# EAGLE schematic GateRhythm (EAGLE 6.5.0)
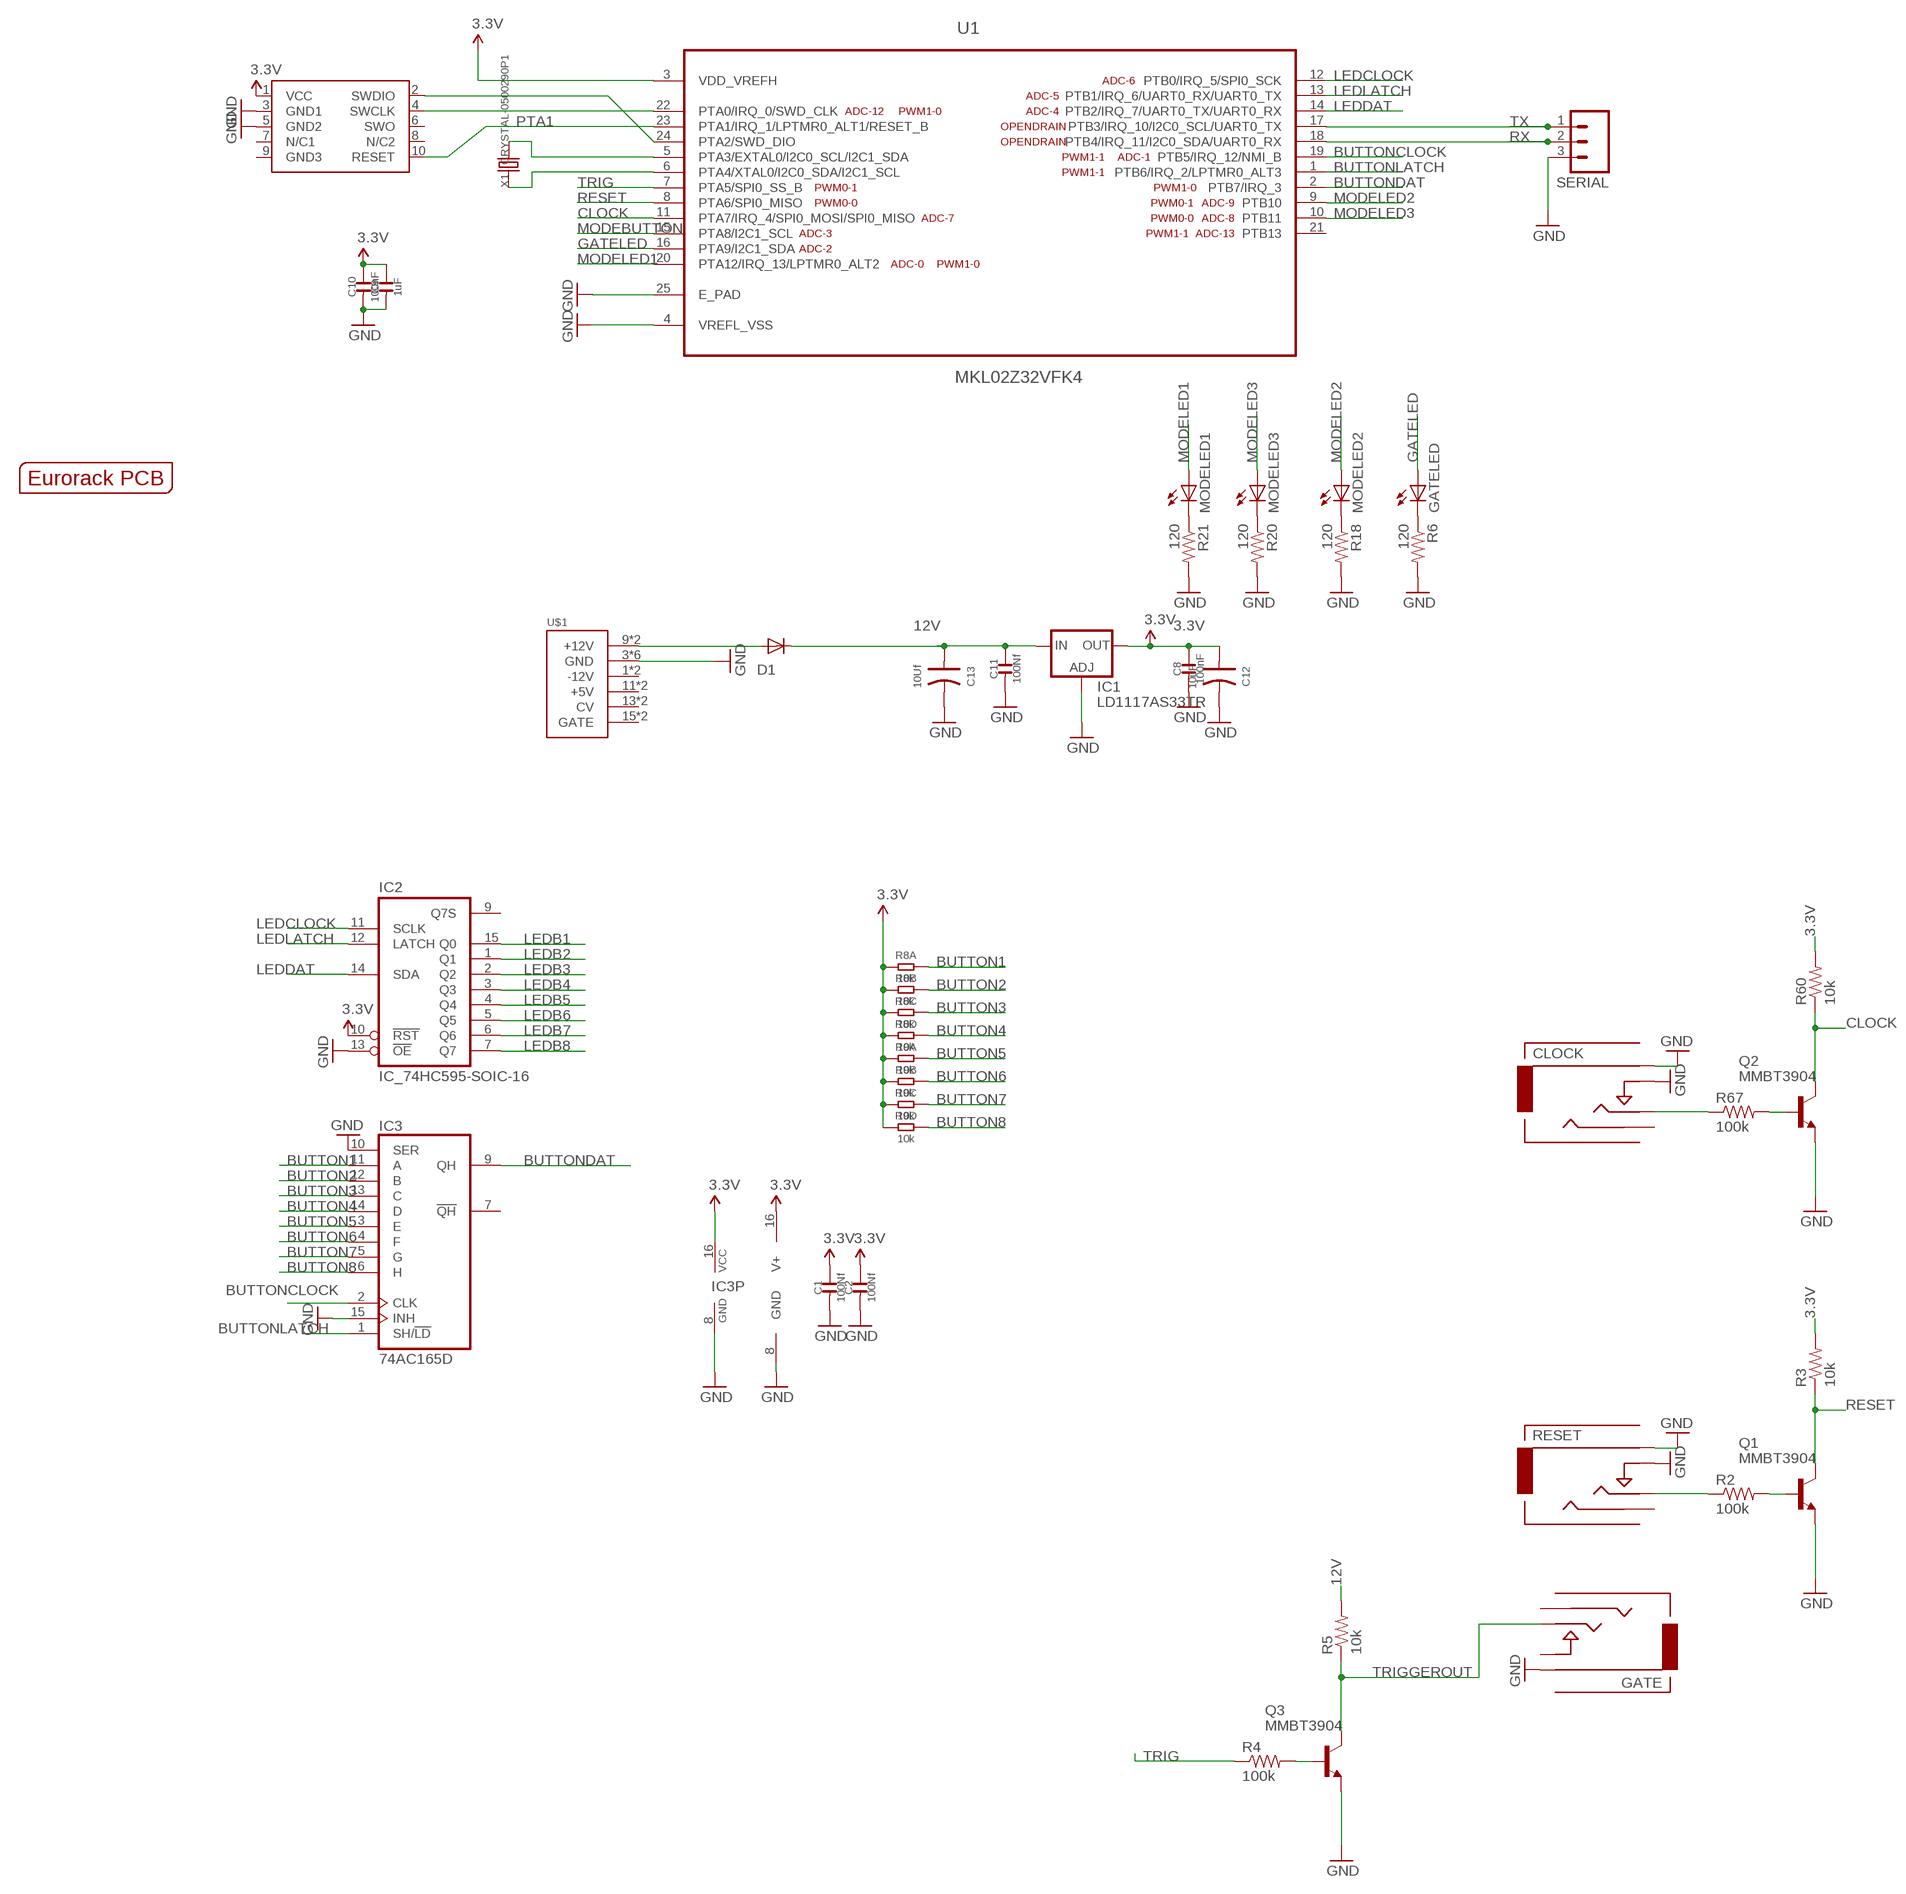
[diagram p0: schematic, sheet 1, part 1 of 2]
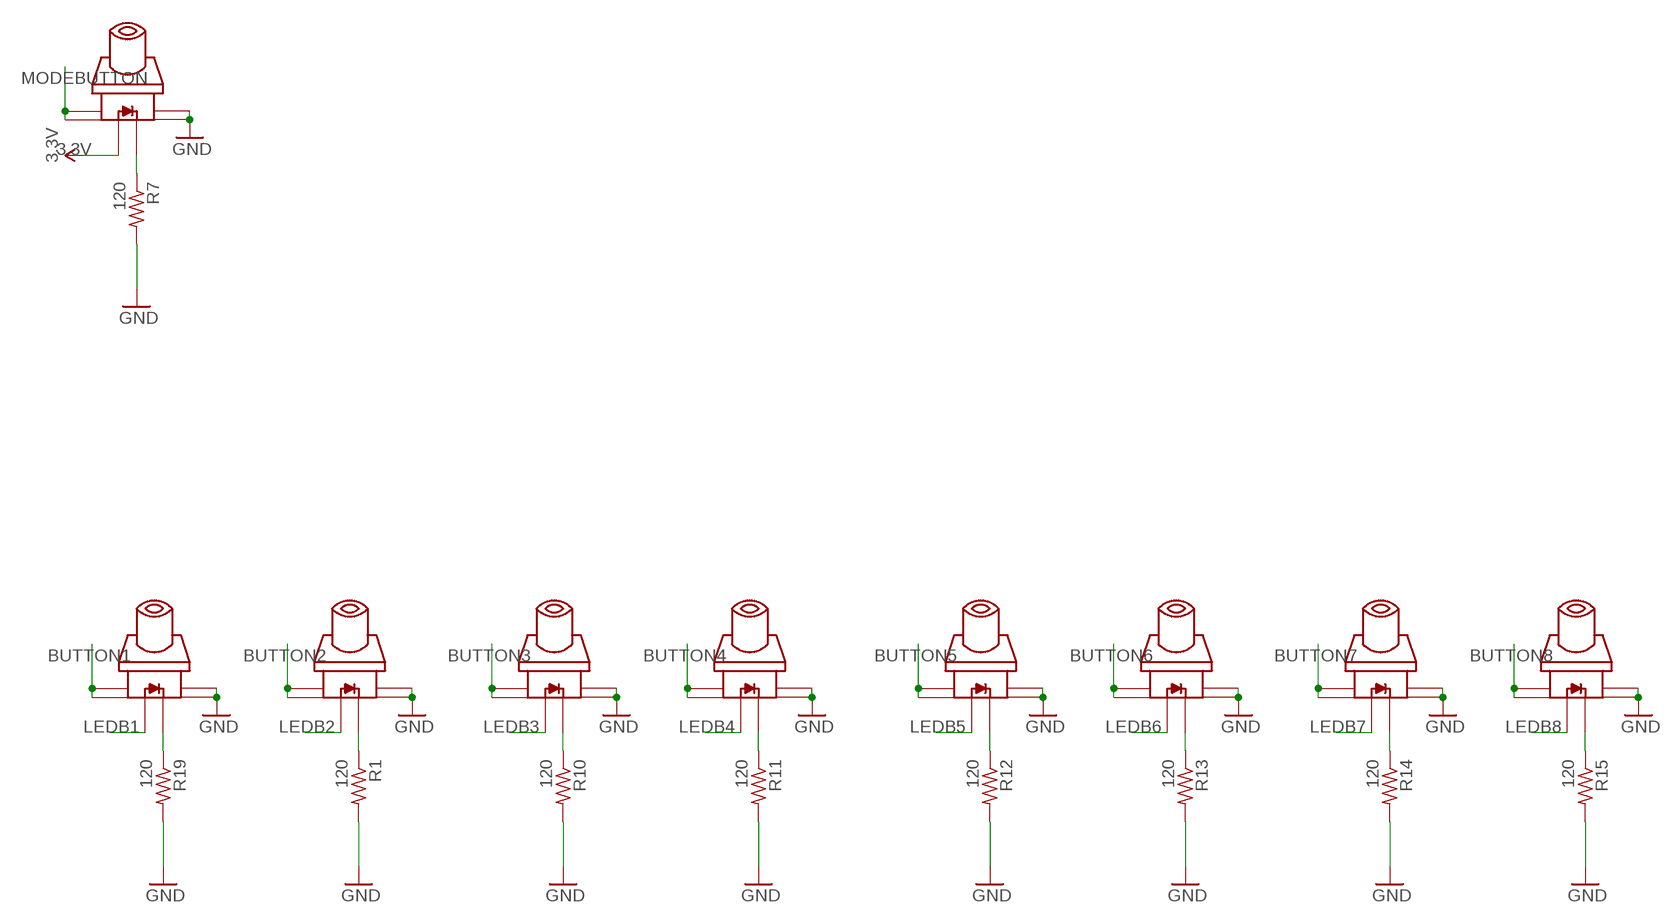
[diagram p1: schematic, sheet 1, part 2 of 2]

## Parts
B1  SWITCH_W_LED_PB6149L-X-102WHITE  [PB6149L]
B2  SWITCH_W_LED_PB6149L-X-102WHITE  [PB6149L]
B3  SWITCH_W_LED_PB6149L-X-102WHITE  [PB6149L]
B4  SWITCH_W_LED_PB6149L-X-102WHITE  [PB6149L]
B5  SWITCH_W_LED_PB6149L-X-102WHITE  [PB6149L]
B6  SWITCH_W_LED_PB6149L-X-102WHITE  [PB6149L]
B7  SWITCH_W_LED_PB6149L-X-102WHITE  [PB6149L]
B8  SWITCH_W_LED_PB6149L-X-102WHITE  [PB6149L]
B9  SWITCH_W_LED_PB6149L-X-102WHITE  [PB6149L]
C1  100Nf  C-0603  [C0603]
C2  100Nf  C-0603  [C0603]
C8  100nF  C-0603  [C0603]
C9  1uF  C-0603  [C0603]
C10  100nF  C-0603  [C0603]
C11  100Nf  C-0603  [C0603]
C12  10uF  C-POLAR-A  [AVX-A]
C13  10Uf  C-POLAR-A  [AVX-A]
CLOCK  Clock  AUDIO-JACKINPUT  [3.5MM-JACK-SWITCH-13MM-INPUT]
D1  1N5819HW  DIODE-SOD123  [SOD123]
GATE  Gate  AUDIO-JACKOUTPUT  [3.5MM-JACK-SWITCH-13MM-OUTPUT]
GATELED  LED3MM  [LED3MM]
IC1  LD1117AS33TR  [SOT223]
IC2  IC_74HC595-SOIC-16  [SOIC-16]
IC3  74AC165D  [SO16]
MODELED1  LED3MM  [LED3MM]
MODELED2  LED3MM  [LED3MM]
MODELED3  LED3MM  [LED3MM]
Q1  MMBT3904  MMBT3904LT1-NPN-SOT23-BEC  [SOT23-BEC]
Q2  MMBT3904  MMBT3904LT1-NPN-SOT23-BEC  [SOT23-BEC]
Q3  MMBT3904  MMBT3904LT1-NPN-SOT23-BEC  [SOT23-BEC]
R1  120  R-US_R0603  [R0603]
R2  100k  R-US_R0603  [R0603]
R3  10k  R-US_R0603  [R0603]
R4  100k  R-US_R0603  [R0603]
R5  10k  R-US_R0603  [R0603]
R6  120  R-US_R0603  [R0603]
R7  120  R-US_R0603  [R0603]
R8  10k  R-4R  [R1206-8]
R9  10k  R-4R  [R1206-8]
R10  120  R-US_R0603  [R0603]
R11  120  R-US_R0603  [R0603]
R12  120  R-US_R0603  [R0603]
R13  120  R-US_R0603  [R0603]
R14  120  R-US_R0603  [R0603]
R15  120  R-US_R0603  [R0603]
R18  120  R-US_R0603  [R0603]
R19  120  R-US_R0603  [R0603]
R20  120  R-US_R0603  [R0603]
R21  120  R-US_R0603  [R0603]
R60  10k  R-US_R0603  [R0603]
R67  100k  R-US_R0603  [R0603]
RESET  Reset  AUDIO-JACKINPUT  [3.5MM-JACK-SWITCH-13MM-INPUT]
SERIAL  M03PTH  [1X03]
SWD1  CORTEX_SWD  [M50-3600542]
U1  MKL02Z32VFK4  [QFN50P400X400X100-25N]
U$1  POWER  [POWER_16]
U$2  EURORACK_PCB6HP  [EURORACK6HPPCB]
X1  CRYSTAL-0500290P1  [2P-SMD-5.0X3.2]

## Nets
3.3V: B9.LEDPOS(POS) C1.2 C2.2 C8.2 C9.2 C10.2 C12.+ IC1.2(OUT) IC1.4(OUT) IC2.10(!RST) IC2.16(V+) IC3.16(VCC) R3.2 R8.1 R8.2 R8.3 R8.4 R9.1 R9.2 R9.3 R9.4 R60.2 SWD1.1(VCC) U1.3(VDD_VREFH)
12V: C11.2 C13.+ D1.C IC1.3(IN) R5.2
BUTTON1: B1.1 B1.2 IC3.11(A) R8.8
BUTTON2: B2.1 B2.2 IC3.12(B) R8.7
BUTTON3: B3.1 B3.2 IC3.13(C) R8.6
BUTTON4: B4.1 B4.2 IC3.14(D) R8.5
BUTTON5: B5.1 B5.2 IC3.3(E) R9.8
BUTTON6: B6.1 B6.2 IC3.4(F) R9.7
BUTTON7: B7.1 B7.2 IC3.5(G) R9.6
BUTTON8: B8.1 B8.2 IC3.6(H) R9.5
BUTTONCLOCK: IC3.2(CLK) U1.19(PTB5/IRQ_12/NMI_B)
BUTTONDAT: IC3.9(QH) U1.2(PTB7/IRQ_3)
BUTTONLATCH: IC3.1(SH/!LD) U1.1(PTB6/IRQ_2/LPTMR0_ALT3)
CLOCK: Q2.C R60.1 U1.11(PTA7/IRQ_4/SPI0_MOSI/SPI0_MISO)
GATELED: GATELED.A U1.16(PTA9/I2C1_SDA)
GND: B1.3 B1.4 B2.3 B2.4 B3.3 B3.4 B4.3 B4.4 B5.3 B5.4 B6.3 B6.4 B7.3 B7.4 B8.3 B8.4 B9.3 B9.4 C1.1 C2.1 C8.1 C9.1 C10.1 C11.1 C12.- C13.- CLOCK.RING@1(RING) CLOCK.RING@2(RING) CLOCK.SWITCH@1(SWITCH) CLOCK.SWITCH@2(SWITCH) GATE.RING@1(RING) GATE.RING@2(RING) IC1.1(ADJ) IC2.8(GND) IC2.13(!OE) IC3.8(GND) IC3.10(SER) IC3.15(INH) Q1.E Q2.E Q3.E R1.2 R6.2 R7.2 R10.2 R11.2 R12.2 R13.2 R14.2 R15.2 R18.2 R19.2 R20.2 R21.2 RESET.RING@1(RING) RESET.RING@2(RING) RESET.SWITCH@1(SWITCH) RESET.SWITCH@2(SWITCH) SERIAL.3 SWD1.3(GND1) SWD1.5(GND2) U1.4(VREFL_VSS) U1.25(E_PAD) U$1.3(GND) U$1.4(GND) U$1.5(GND) U$1.6(GND) U$1.7(GND) U$1.8(GND)
LEDB1: B1.LEDPOS(POS) IC2.15(Q0)
LEDB2: B2.LEDPOS(POS) IC2.1(Q1)
LEDB3: B3.LEDPOS(POS) IC2.2(Q2)
LEDB4: B4.LEDPOS(POS) IC2.3(Q3)
LEDB5: B5.LEDPOS(POS) IC2.4(Q4)
LEDB6: B6.LEDPOS(POS) IC2.5(Q5)
LEDB7: B7.LEDPOS(POS) IC2.6(Q6)
LEDB8: B8.LEDPOS(POS) IC2.7(Q7)
LEDCLOCK: IC2.11(SCLK) U1.12(PTB0/IRQ_5/SPI0_SCK)
LEDDAT: IC2.14(SDA) U1.14(PTB2/IRQ_7/UART0_TX/UART0_RX)
LEDLATCH: IC2.12(LATCH) U1.13(PTB1/IRQ_6/UART0_RX/UART0_TX)
MODEBUTTON: B9.1 B9.2 U1.15(PTA8/I2C1_SCL)
MODELED1: MODELED1.A U1.20(PTA12/IRQ_13/LPTMR0_ALT2)
MODELED2: MODELED2.A U1.9(PTB10)
MODELED3: MODELED3.A U1.10(PTB11)
N$1: U1.5(PTA3/EXTAL0/I2C0_SCL/I2C1_SDA) X1.2
N$2: U1.6(PTA4/XTAL0/I2C0_SDA/I2C1_SCL) X1.1
N$3: B2.LEDNEG(NEG) R1.1
N$4: Q1.B R2.2
N$5: SWD1.4(SWCLK) U1.22(PTA0/IRQ_0/SWD_CLK)
N$6: R2.1 RESET.TIP@1(TIP) RESET.TIP@2(TIP)
N$7: SWD1.2(SWDIO) U1.24(PTA2/SWD_DIO)
N$8: B3.LEDNEG(NEG) R10.1
N$9: Q3.B R4.2
N$10: GATELED.K(C) R6.1
N$11: B9.LEDNEG(NEG) R7.1
N$13: D1.A U$1.9(+12V) U$1.10(+12V)
N$14: B1.LEDNEG(NEG) R19.1
N$15: MODELED2.K(C) R18.1
N$16: MODELED3.K(C) R20.1
N$17: MODELED1.K(C) R21.1
N$19: B4.LEDNEG(NEG) R11.1
N$20: B5.LEDNEG(NEG) R12.1
N$21: B6.LEDNEG(NEG) R13.1
N$22: B7.LEDNEG(NEG) R14.1
N$23: B8.LEDNEG(NEG) R15.1
N$43: CLOCK.TIP@1(TIP) CLOCK.TIP@2(TIP) R67.1
N$66: Q2.B R67.2
PTA1: SWD1.10(RESET) U1.23(PTA1/IRQ_1/LPTMR0_ALT1/RESET_B)
RESET: Q1.C R3.1 U1.8(PTA6/SPI0_MISO)
RX: SERIAL.2 U1.18(PTB4/IRQ_11/I2C0_SDA/UART0_RX)
TRIG: R4.1 U1.7(PTA5/SPI0_SS_B)
TRIGGEROUT: GATE.TIP@1(TIP) GATE.TIP@2(TIP) Q3.C R5.1
TX: SERIAL.1 U1.17(PTB3/IRQ_10/I2C0_SCL/UART0_TX)
Unconnected: CLOCK.SECOND@1(SECOND) CLOCK.SECOND@2(SECOND) GATE.SECOND@1(SECOND) GATE.SECOND@2(SECOND) GATE.SWITCH@1(SWITCH) GATE.SWITCH@2(SWITCH) IC2.9(Q7S) IC3.7(!QH) RESET.SECOND@1(SECOND) RESET.SECOND@2(SECOND) SWD1.6(SWO) SWD1.7(N/C1) SWD1.8(N/C2) SWD1.9(GND3) U1.21(PTB13) U$1.1(-12V) U$1.2(-12V) U$1.11(+5V) U$1.12(+5V) U$1.13(CV) U$1.14(CV) U$1.15(GATE) U$1.16(GATE)

## Library data of the parts
B1-B9 = zephod-components:SWITCH_W_LED_PB6149L-X-102
C1 C2 C8-C11 = OPL:C*
C12 C13 = OPL:C-POLAR*
CLOCK GATE RESET = EurorackModularParts:AUDIO-JACK: Switching Mono 3.5mm Audio Jack from Erthenvar.
D1 = diode:DIODE-: DIODE
GATELED MODELED1-MODELED3 = SparkFun-LED:LED: LEDs Standard schematic elements and footprints for 5mm, 3mm, 1206, and 0603 sized LEDs. 5mm - Spark Fun Electronics SKU : COM-00529 (and others)
IC1 = ld-components:LD1117A?*: Low drop fixed and adjustable positive voltage regulators 1 A Source: http://www.st.com/stonline/products/literature/ds/7194/ld1117axx.pdf
IC2 = dp_devices:IC_74HC595: 8-bit serial-in parallel out shift register, output latch 3-state
IC3 = 74xx-eu:74*165: 8-bit parallel load SHIFT REGISTER
Q1-Q3 = transistor:*-NPN-: NPN Transistror BF959 corrected 2008.03.06
R1-R7 R10-R15 R18-R21 R60 R67 = rcl:R-US_: RESISTOR, American symbol
R8 R9 = OPL:R-4R*: Resistor Array
SERIAL = SparkFun-Connectors:M03: Header 3 Standard 3-pin 0.1" header. Use with straight break away headers (SKU : PRT-00116), right angle break away headers (PRT-00553), swiss pins (PRT-00743), machine pins (PRT-00117), and female headers (PRT-00115). Molex polarized connector foot print use with SKU : PRT-08232 with associated crimp pins and housings.
SWD1 = carrilib with jtags:CORTEX_SWD: .05" Cortex M Connector in SWD mode Manufacturer: Generic Part Number: Cortex M SWD Notes: I use Harwin M50-3600542 connectors
U1 = FarnellThings:MKL02Z32VFK4: IC, MCU, 32BIT, CORTEX M0+, 48MHZ, QFN-24; MPN: MKL02Z32VFK4; OC_FARNELL: 2321481; OC_NEWARK: 61W9887; PACKAGE: QFN-24; SUPPLIER: FREESCALE SEMICONDUCTOR
U$1 = eurorack:POWER
U$2 = EurorackModularParts:EURORACK_PCB
X1 = OPL:CRYSTAL*